# EAGLE design CIRCUIT (EAGLE 9.6.2)
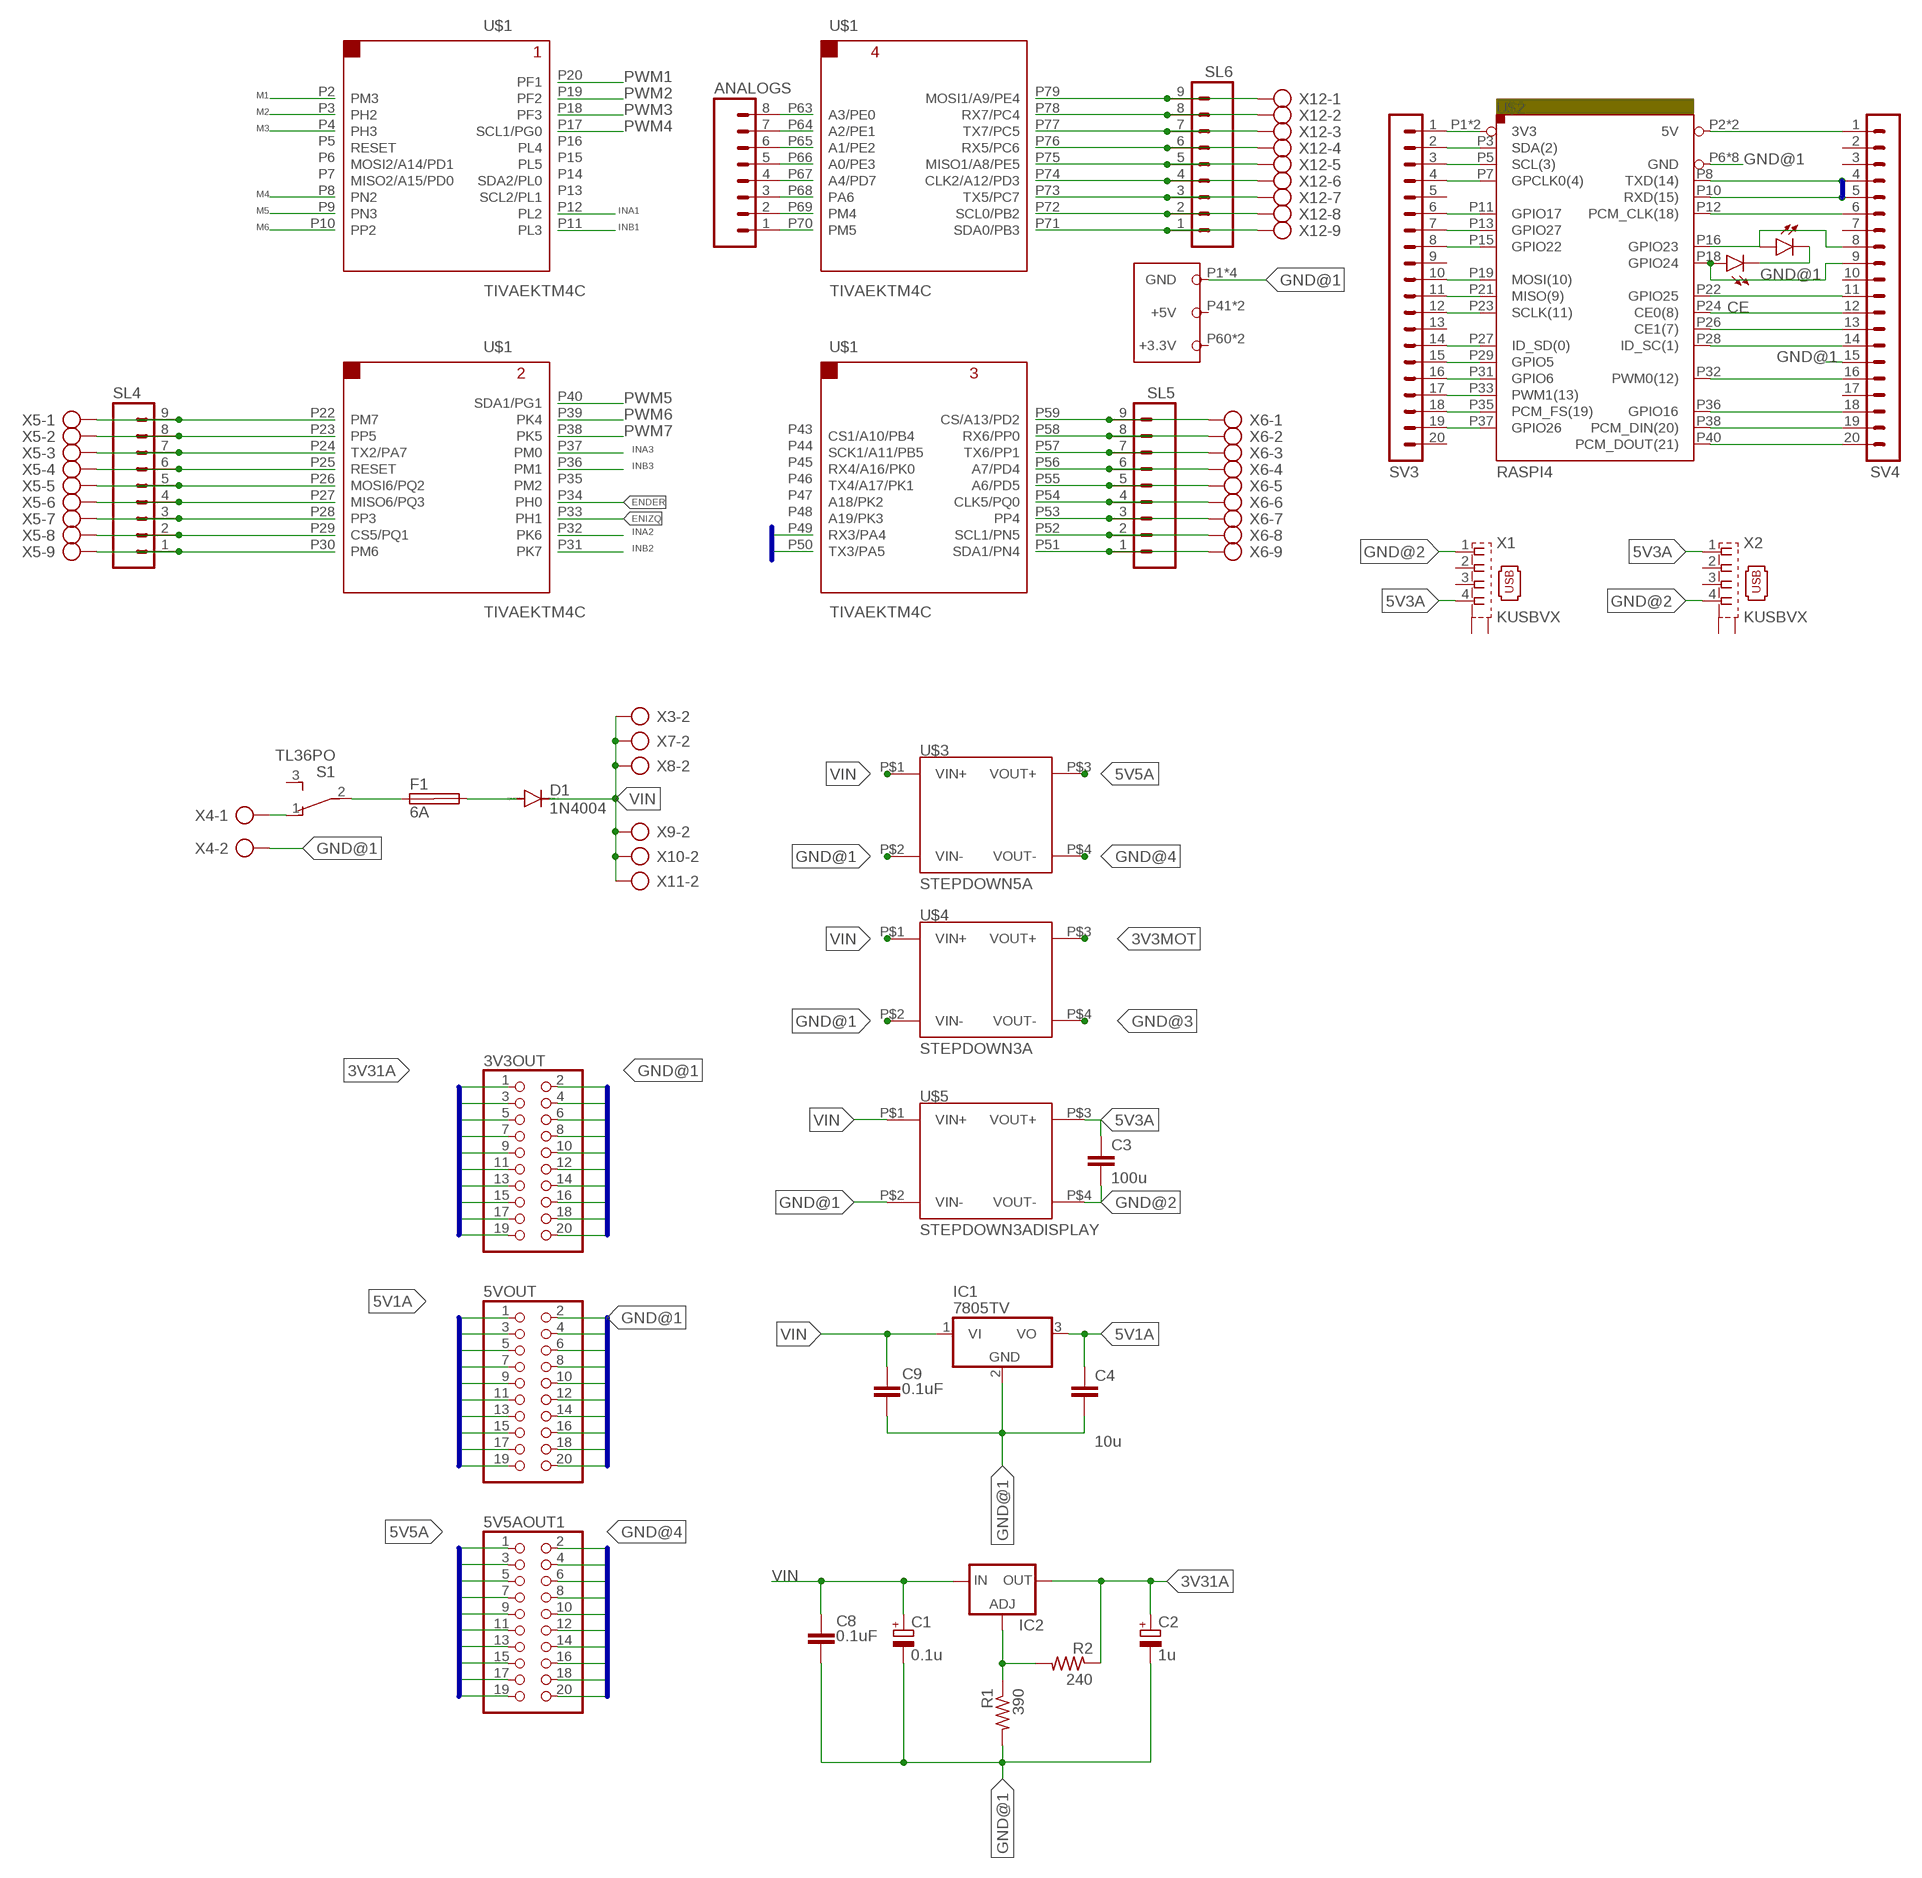
[diagram p0: schematic, sheet 1, part 1 of 2]
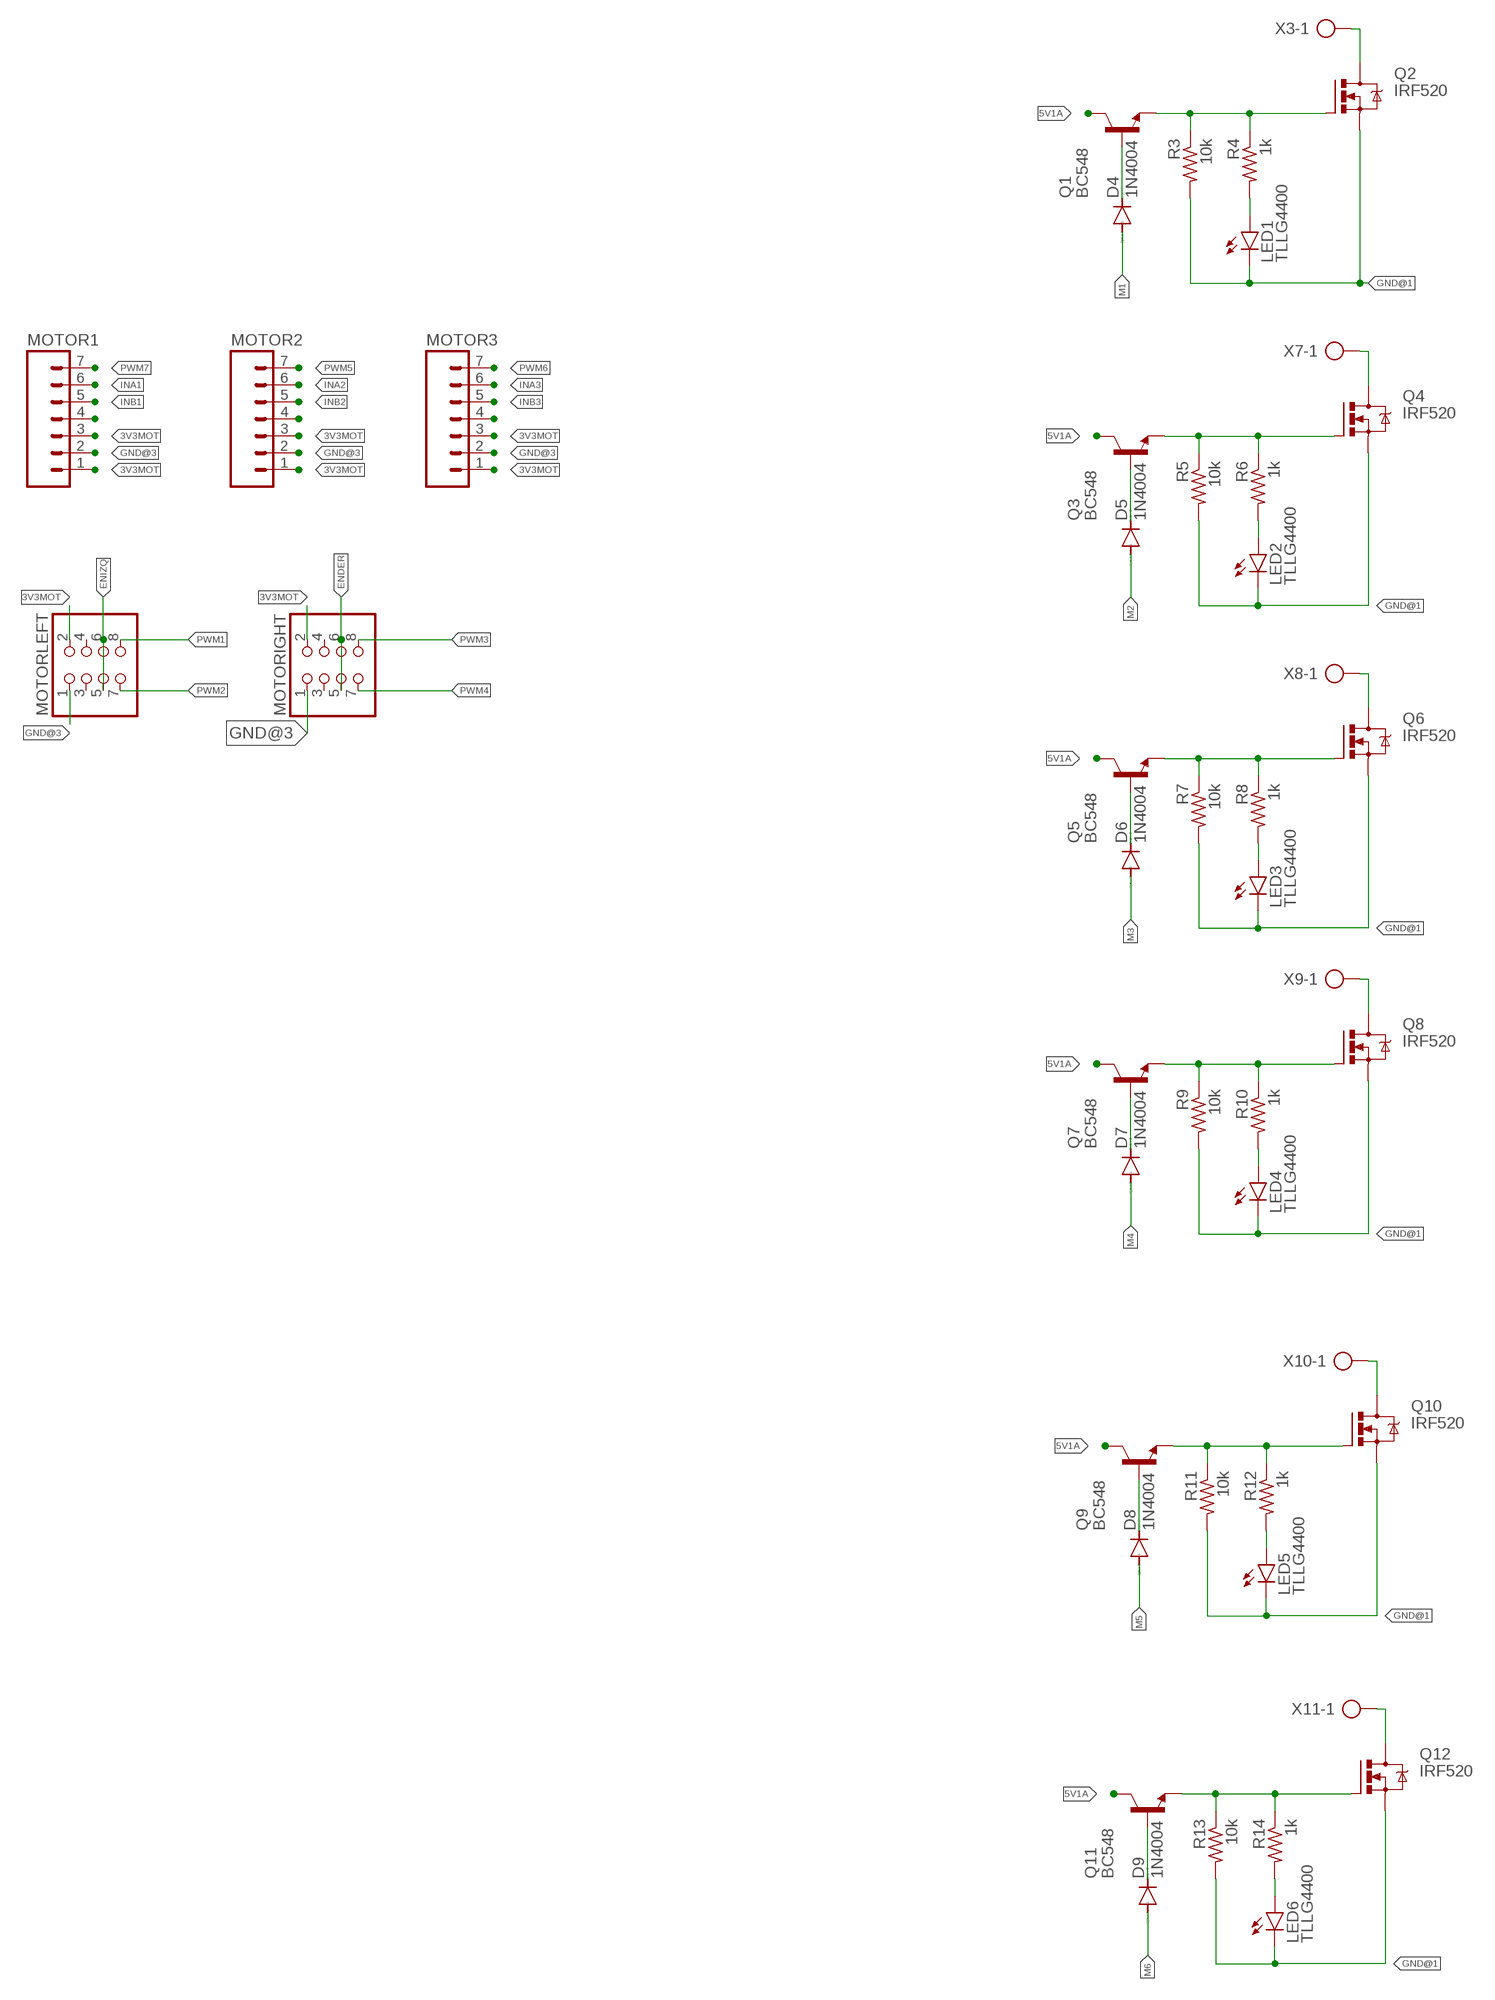
[diagram p1: schematic, sheet 1, part 2 of 2]

## Parts
3V3OUT  PINHD-2X10  [2X10]
5V5AOUT1  PINHD-2X10  [2X10]
5VOUT  PINHD-2X10  [2X10]
ANALOGS  MA08  [08PA]
C1  0.1u  CPOL-EUE5-10.5  [E5-10,5]
C2  1u  CPOL-EUE5-10.5  [E5-10,5]
C3  100u  C-EU025-024X044  [C025-024X044]
C4  10u  C-EU025-024X044  [C025-024X044]
C8  0.1uF  C-EU075-052X106  [C075-052X106]
C9  0.1uF  C-EU075-052X106  [C075-052X106]
D1  1N4004  [DO41-10]
D2  SFH482  [SFH482]
D3  SFH482  [SFH482]
D4  1N4004  [DO41-10]
D5  1N4004  [DO41-10]
D6  1N4004  [DO41-10]
D7  1N4004  [DO41-10]
D8  1N4004  [DO41-10]
D9  1N4004  [DO41-10]
F1  6A  SHK20L  [SHK20L]
IC1  7805TV  [TO220V]
IC2  LM317TL  [317TL]
LED1  TLLG4400  [LED3MM]
LED2  TLLG4400  [LED3MM]
LED3  TLLG4400  [LED3MM]
LED4  TLLG4400  [LED3MM]
LED5  TLLG4400  [LED3MM]
LED6  TLLG4400  [LED3MM]
MOTOR1  MA07  [07PA]
MOTOR2  MA07  [07PA]
MOTOR3  MA07  [07PA]
MOTORIGHT  PINHD-2X4  [2X04]
MOTORLEFT  PINHD-2X4  [2X04]
Q1  BC548  [TO92-EBC]
Q2  IRF520  [TO220BV]
Q3  BC548  [TO92-EBC]
Q4  IRF520  [TO220BV]
Q5  BC548  [TO92-EBC]
Q6  IRF520  [TO220BV]
Q7  BC548  [TO92-EBC]
Q8  IRF520  [TO220BV]
Q9  BC548  [TO92-EBC]
Q10  IRF520  [TO220BV]
Q11  BC548  [TO92-EBC]
Q12  IRF520  [TO220BV]
R1  390  R-US_0207/10  [0207/10]
R2  240  R-US_0207/10  [0207/10]
R3  10k  R-US_0207/10  [0207/10]
R4  1k  R-US_0207/10  [0207/10]
R5  10k  R-US_0207/10  [0207/10]
R6  1k  R-US_0207/10  [0207/10]
R7  10k  R-US_0207/10  [0207/10]
R8  1k  R-US_0207/10  [0207/10]
R9  10k  R-US_0207/10  [0207/10]
R10  1k  R-US_0207/10  [0207/10]
R11  10k  R-US_0207/10  [0207/10]
R12  1k  R-US_0207/10  [0207/10]
R13  10k  R-US_0207/10  [0207/10]
R14  1k  R-US_0207/10  [0207/10]
S1  TL36PO  [TL3XPO]
SL4  M09  [09P]
SL5  M09  [09P]
SL6  M09  [09P]
SV3  MA20-1  [MA20-1]
SV4  MA20-1  [MA20-1]
U$1  TIVAEKTM4C  [TIVAPINESPCB]
U$2  RASPI4  [CONN2-SIL40]
U$3  STEPDOWN5A  [REGULADORSTEP-DOWN5ACURRENT]
U$4  STEPDOWN3A  [REGULADORSTEP-DOWN3A]
U$5  STEPDOWN3ADISPLAY  [REGULADORWITHDISPLAY]
X1  KUSBVX  [KUSBVX]
X2  KUSBVX  [KUSBVX]
X3  AK300/2  [AK300/2]
X4  AK300/2  [AK300/2]
X5  AK300/9  [AK300/9]
X6  AK300/9  [AK300/9]
X7  AK300/2  [AK300/2]
X8  AK300/2  [AK300/2]
X9  AK300/2  [AK300/2]
X10  AK300/2  [AK300/2]
X11  AK300/2  [AK300/2]
X12  AK300/9  [AK300/9]

## Nets
3V3MOT [outsVoltaje]: MOTOR1.1 MOTOR1.3 MOTOR2.1 MOTOR2.3 MOTOR3.1 MOTOR3.3 MOTORIGHT.2 MOTORLEFT.2 U$4.P$3(VOUT+)
3V31A [outsVoltaje]: 3V3OUT.1 3V3OUT.3 3V3OUT.5 3V3OUT.7 3V3OUT.9 3V3OUT.11 3V3OUT.13 3V3OUT.15 3V3OUT.17 3V3OUT.19 C2.+ IC2.2(OUT) R2.1
5V1A [outsVoltaje]: 5VOUT.1 5VOUT.3 5VOUT.5 5VOUT.7 5VOUT.9 5VOUT.11 5VOUT.13 5VOUT.15 5VOUT.17 5VOUT.19 C4.1 IC1.3(VO) Q1.C Q3.C Q5.C Q7.C Q9.C Q11.C
5V3A [outsVoltaje]: C3.1 U$5.P$3(VOUT+) X1.4 X2.1
5V5A [outsVoltaje]: 5V5AOUT1.1 5V5AOUT1.3 5V5AOUT1.5 5V5AOUT1.7 5V5AOUT1.9 5V5AOUT1.11 5V5AOUT1.13 5V5AOUT1.15 5V5AOUT1.17 5V5AOUT1.19 U$3.P$3(VOUT+)
CE: SV4.12 U$2.P24(CE0(8))
CLK [signals]: SV3.12 U$2.P23(SCLK(11))
ENDER [signals]: MOTORIGHT.5 MOTORIGHT.6 U$1.P34(PH0)
ENIZQ [signals]: MOTORLEFT.5 MOTORLEFT.6 U$1.P33(PH1)
GND@1 [gnds]: 3V3OUT.2 3V3OUT.4 3V3OUT.6 3V3OUT.8 3V3OUT.10 3V3OUT.12 3V3OUT.14 3V3OUT.16 3V3OUT.18 3V3OUT.20 5VOUT.2 5VOUT.4 5VOUT.6 5VOUT.8 5VOUT.10 5VOUT.12 5VOUT.14 5VOUT.16 5VOUT.18 5VOUT.20 C4.2 C9.2 D2.K(C) D3.K(C) IC1.2(GND) LED1.K(C) LED2.K(C) LED3.K(C) LED4.K(C) LED5.K(C) LED6.K(C) Q2.S Q4.S Q6.S Q8.S Q10.S Q12.S R3.2 R5.2 R7.2 R9.2 R11.2 R13.2 SV4.15 U$1.P1(GND) U$1.P21(GND) U$1.P42(GND) U$1.P62(GND) U$2.P6(GND) U$2.P9(GND) U$2.P14(GND) U$2.P20(GND) U$2.P25(GND) U$2.P30(GND) U$2.P34(GND) U$2.P39(GND) U$3.P$2(VIN-) U$4.P$2(VIN-) U$5.P$2(VIN-) X4.2
GND@2 [gnds]: C3.2 U$5.P$4(VOUT-) X1.1 X2.4
GND@3 [gnds]: MOTOR1.2 MOTOR2.2 MOTOR3.2 MOTORIGHT.1 MOTORLEFT.1 U$4.P$4(VOUT-)
GND@4 [gnds]: 5V5AOUT1.2 5V5AOUT1.4 5V5AOUT1.6 5V5AOUT1.8 5V5AOUT1.10 5V5AOUT1.12 5V5AOUT1.14 5V5AOUT1.16 5V5AOUT1.18 5V5AOUT1.20 U$3.P$4(VOUT-)
INA1 [signals]: MOTOR1.6 U$1.P12(PL2)
INA2 [signals]: MOTOR2.6 U$1.P32(PK6)
INA3 [signals]: MOTOR3.6 U$1.P37(PM0)
INB1 [signals]: MOTOR1.5 U$1.P11(PL3)
INB2 [signals]: MOTOR2.5 U$1.P31(PK7)
INB3 [signals]: MOTOR3.5 U$1.P36(PM1)
M1 [signals]: D4.A U$1.P2(PM3)
M2 [signals]: D5.A U$1.P3(PH2)
M3 [signals]: D6.A U$1.P4(PH3)
M4 [signals]: D7.A U$1.P8(PN2)
M5 [signals]: D8.A U$1.P9(PN3)
M6 [signals]: D9.A U$1.P10(PP2)
MISO [signals]: SV3.10 SV3.11 U$2.P19(MOSI(10)) U$2.P21(MISO(9))
N$1: S1.1(O) X4.1
N$2: F1.1A S1.2(P)
N$3: IC2.1(ADJ) R1.1 R2.2
N$4: SV3.1 U$2.P1(3V3) U$2.P17(3V3)
N$5: C1.- C2.- C8.2 R1.2
N$8: SV3.2 U$2.P3(SDA(2))
N$9: SV3.3 U$2.P5(SCL(3))
N$10: SV3.4 U$2.P7(GPCLK0(4))
N$11: SV3.6 U$2.P11(GPIO17)
N$12: SV3.7 U$2.P13(GPIO27)
N$13: SV3.8 U$2.P15(GPIO22)
N$14: D1.A F1.2A
N$15: MOTOR2.4
N$16: MOTOR3.4
N$17: SV3.14 U$2.P27(ID_SD(0))
N$18: SV3.15 U$2.P29(GPIO5)
N$19: SV3.16 U$2.P31(GPIO6)
N$20: SV3.17 U$2.P33(PWM1(13))
N$21: SV3.18 U$2.P35(PCM_FS(19))
N$22: SV3.19 U$2.P37(GPIO26)
N$23: SV4.1 U$2.P2(5V) U$2.P4(5V)
N$24: D4.C Q1.B
N$25: MOTOR1.4
N$26: SV4.6 U$2.P12(PCM_CLK(18))
N$27: D3.A SV4.9 U$2.P18(GPIO24)
N$28: Q1.E Q2.G R3.1 R4.1
N$29: SV4.11 U$2.P22(GPIO25)
N$30: LED1.A R4.2
N$31 [signals]: D5.C Q3.B
N$32: SV4.13 U$2.P26(CE1(7))
N$33: SV4.14 U$2.P28(ID_SC(1))
N$34: SV4.16 U$2.P32(PWM0(12))
N$35: SV4.18 U$2.P36(GPIO16)
N$36: SV4.19 U$2.P38(PCM_DIN(20))
N$37: SV4.20 U$2.P40(PCM_DOUT(21))
N$38: D2.A SV4.8 U$2.P16(GPIO23)
N$39: Q2.D X3.1
N$40: SL4.9 U$1.P22(PM7) X5.1
N$41: Q3.E Q4.G R5.1 R6.1
N$42: LED2.A R6.2
N$43 [signals]: Q4.D X7.1
N$44: D6.C Q5.B
N$45: Q5.E Q6.G R7.1 R8.1
N$46: LED3.A R8.2
N$47: Q6.D X8.1
N$48: D7.C Q7.B
N$49: Q7.E Q8.G R9.1 R10.1
N$50: LED4.A R10.2
N$51: Q8.D X9.1
N$52: D8.C Q9.B
N$53: Q9.E Q10.G R11.1 R12.1
N$54: LED5.A R12.2
N$55: Q10.D X10.1
N$56: D9.C Q11.B
N$57: Q11.E Q12.G R13.1 R14.1
N$58: LED6.A R14.2
N$59: Q12.D X11.1
N$60: SL4.8 U$1.P23(PP5) X5.2
N$61: SL4.7 U$1.P24(TX2/PA7) X5.3
N$62: SL4.6 U$1.P25(RESET) X5.4
N$63: SL4.5 U$1.P26(MOSI6/PQ2) X5.5
N$64: SL4.4 U$1.P27(MISO6/PQ3) X5.6
N$65: SL4.3 U$1.P28(PP3) X5.7
N$66: SL4.2 U$1.P29(CS5/PQ1) X5.8
N$67: SL4.1 U$1.P30(PM6) X5.9
N$68: SL6.9 U$1.P79(MOSI1/A9/PE4) X12.1
N$69: SL6.8 U$1.P78(RX7/PC4) X12.2
N$70: SL6.7 U$1.P77(TX7/PC5) X12.3
N$71: SL6.6 U$1.P76(RX5/PC6) X12.4
N$72: SL6.5 U$1.P75(MISO1/A8/PE5) X12.5
N$73: SL6.4 U$1.P74(CLK2/A12/PD3) X12.6
N$74: SL6.3 U$1.P73(TX5/PC7) X12.7
N$75: SL6.2 U$1.P72(SCL0/PB2) X12.8
N$76: SL6.1 U$1.P71(SDA0/PB3) X12.9
N$77: SL5.9 U$1.P59(CS/A13/PD2) X6.1
N$78: SL5.8 U$1.P58(RX6/PP0) X6.2
N$79: SL5.7 U$1.P57(TX6/PP1) X6.3
N$80: SL5.6 U$1.P56(A7/PD4) X6.4
N$81: SL5.5 U$1.P55(A6/PD5) X6.5
N$82: SL5.4 U$1.P54(CLK5/PQ0) X6.6
N$83: SL5.3 U$1.P53(PP4) X6.7
N$84: SL5.2 U$1.P52(SCL1/PN5) X6.8
N$85: SL5.1 U$1.P51(SDA1/PN4) X6.9
N$86: ANALOGS.8 U$1.P63(A3/PE0)
N$87: ANALOGS.7 U$1.P64(A2/PE1)
N$88: ANALOGS.6 U$1.P65(A1/PE2)
N$89: ANALOGS.5 U$1.P66(A0/PE3)
N$90: ANALOGS.4 U$1.P67(A4/PD7)
N$91: ANALOGS.3 U$1.P68(PA6)
N$92: ANALOGS.2 U$1.P69(PM4)
N$93: ANALOGS.1 U$1.P70(PM5)
PWM1: MOTORLEFT.8 U$1.P20(PF1)
PWM2 [signals]: MOTORLEFT.7 U$1.P19(PF2)
PWM3 [signals]: MOTORIGHT.8 U$1.P18(PF3)
PWM4 [signals]: MOTORIGHT.7 U$1.P17(SCL1/PG0)
PWM5 [signals]: MOTOR2.7 U$1.P40(SDA1/PG1)
PWM6 [signals]: MOTOR3.7 U$1.P39(PK4)
PWM7: MOTOR1.7 U$1.P38(PK5)
RX [signals]: SV4.5 U$2.P10(RXD(15))
RX3 [signals]: U$1.P49(RX3/PA4)
TX [signals]: SV4.4 U$2.P8(TXD(14))
TX3 [signals]: U$1.P50(TX3/PA5)
VIN [VInbat]: C1.+ C8.1 C9.1 D1.C IC1.1(VI) IC2.3(IN) U$3.P$1(VIN+) U$4.P$1(VIN+) U$5.P$1(VIN+) X3.2 X7.2 X8.2 X9.2 X10.2 X11.2
Unconnected: F1.1B F1.2B MOTORIGHT.3 MOTORIGHT.4 MOTORLEFT.3 MOTORLEFT.4 S1.3(S) SV3.5 SV3.9 SV3.13 SV3.20 SV4.2 SV4.3 SV4.7 SV4.10 SV4.17 U$1.P5(RESET) U$1.P6(MOSI2/A14/PD1) U$1.P7(MISO2/A15/PD0) U$1.P13(SCL2/PL1) U$1.P14(SDA2/PL0) U$1.P15(PL5) U$1.P16(PL4) U$1.P35(PM2) U$1.P41(+5V) U$1.P43(CS1/A10/PB4) U$1.P44(SCK1/A11/PB5) U$1.P45(RX4/A16/PK0) U$1.P46(TX4/A17/PK1) U$1.P47(A18/PK2) U$1.P48(A19/PK3) U$1.P60(+3.3V) U$1.P61(+5V) U$1.P80(+3.3V) X1.2 X1.3 X1.M1(S1) X1.M2(S2) X2.2 X2.3 X2.M1(S1) X2.M2(S2)

## Buses
5V1A:5V1A
GNDS:GND@1
3V31AS:3V31A
UARTIVA:RX3,TX3
UARTRASP:RX,TX
5V5A
GND@4

## Library data of the parts
3V3OUT 5V5AOUT1 5VOUT = pinhead:PINHD-2X10: PIN HEADER
ANALOGS = con-amp-quick:MA08: AMP QUICK CONNECTOR; OC_FARNELL: unknown; OC_NEWARK: unknown
C1 C2 = rcl:CPOL-EU: POLARIZED CAPACITOR, European symbol; SPICEPREFIX: C
C3 C4 C8 C9 = rcl:C-EU: CAPACITOR, European symbol; SPICEPREFIX: C
D1 D4-D9 = diode:1N4004: DIODE general purpose rectifier, 1 A
D2 D3 = led:SFH482: IR LED infrared emitting diode, Infineon
F1 = fuse:SHK20L: FUSE HOLDER 5 x 20 mm, SH contact, SHH1 Schukat, E1073 Buerklin; OC_FARNELL: unknown; OC_NEWARK: unknown
IC1 = linear:78*: Positive VOLTAGE REGULATOR Source: http://cache.national.com/ds/LM/LM78L05.pdf http://www.fairchildsemi.com/ds/LM/LM7805.pdf
IC2 = v-reg:LM317TL: VOLTAGE REGULATOR
LED1-LED6 = led:TLLG4400: Low Current (2mA) LED 3 mm Tinted Diffused Package color GREEN Source: Data sheet <http://www.farnell.com/datasheets/391098.pdf>; MF: VISHAY SEMICONDUCTOR; OC_FARNELL: 1612435
MOTOR1-MOTOR3 = con-amp-quick:MA07: AMP QUICK CONNECTOR; OC_FARNELL: unknown; OC_NEWARK: unknown
MOTORIGHT MOTORLEFT = pinhead:PINHD-2X4: PIN HEADER
Q1 Q3 Q5 Q7 Q9 Q11 = transistor-npn:BC548*: NPN Transistor
Q2 Q4 Q6 Q8 Q10 Q12 = transistor-power:IRF520: HEXFET Power MOSFET
R1-R14 = rcl:R-US_: RESISTOR, American symbol; SPICEPREFIX: R
S1 = switch:TL36PO: TINY SWITCH ON - ON Source: http://www2.produktinfo.conrad.com/datenblaetter/700000-724999/705152-da-01-de-Subminiaturschalter_TL_36YO.pdf
SL4-SL6 = con-amp-quick:M09: AMP QUICK CONNECTOR; OC_FARNELL: unknown; OC_NEWARK: unknown
SV3 SV4 = con-lstb:MA20-1: PIN HEADER; OC_FARNELL: unknown; OC_NEWARK: unknown
U$1 = TivaConnector:TIVAEKTM4C
U$2 = RaspConnector:RASPI4
U$3 = ReguladoresStep:STEPDOWN5A
U$4 = ReguladoresStep:STEPDOWN3A
U$5 = ReguladoresStep:STEPDOWN3ADISPLAY
X1 X2 = con-kycon:KUSBVX: Vertical,Top Entry Universal Serial Bus Connector KUSBVX Series Source: KYCON Sibalco USB vertical socket KUSBV.pdf
X3 X4 X7-X11 = con-ptr500:AK300/2: CONNECTOR; OC_FARNELL: unknown; OC_NEWARK: unknown
X5 X6 X12 = con-ptr500:AK300/9: CONNECTOR; OC_FARNELL: unknown; OC_NEWARK: unknown

## Net classes
0 default: width 1.016 mm, drill 2.032 mm, clearance 0.508 mm
3 VInbat: width 2.032 mm, drill 2.032 mm, clearance 0.508 mm
5 outsVoltaje: width 1.524 mm, drill 2.032 mm, clearance 0.508 mm
6 signals: width 1.016 mm, drill 2.032 mm, clearance 0.508 mm
7 gnds: width 0.762 mm, drill 2.032 mm, clearance 0.508 mm

## Board
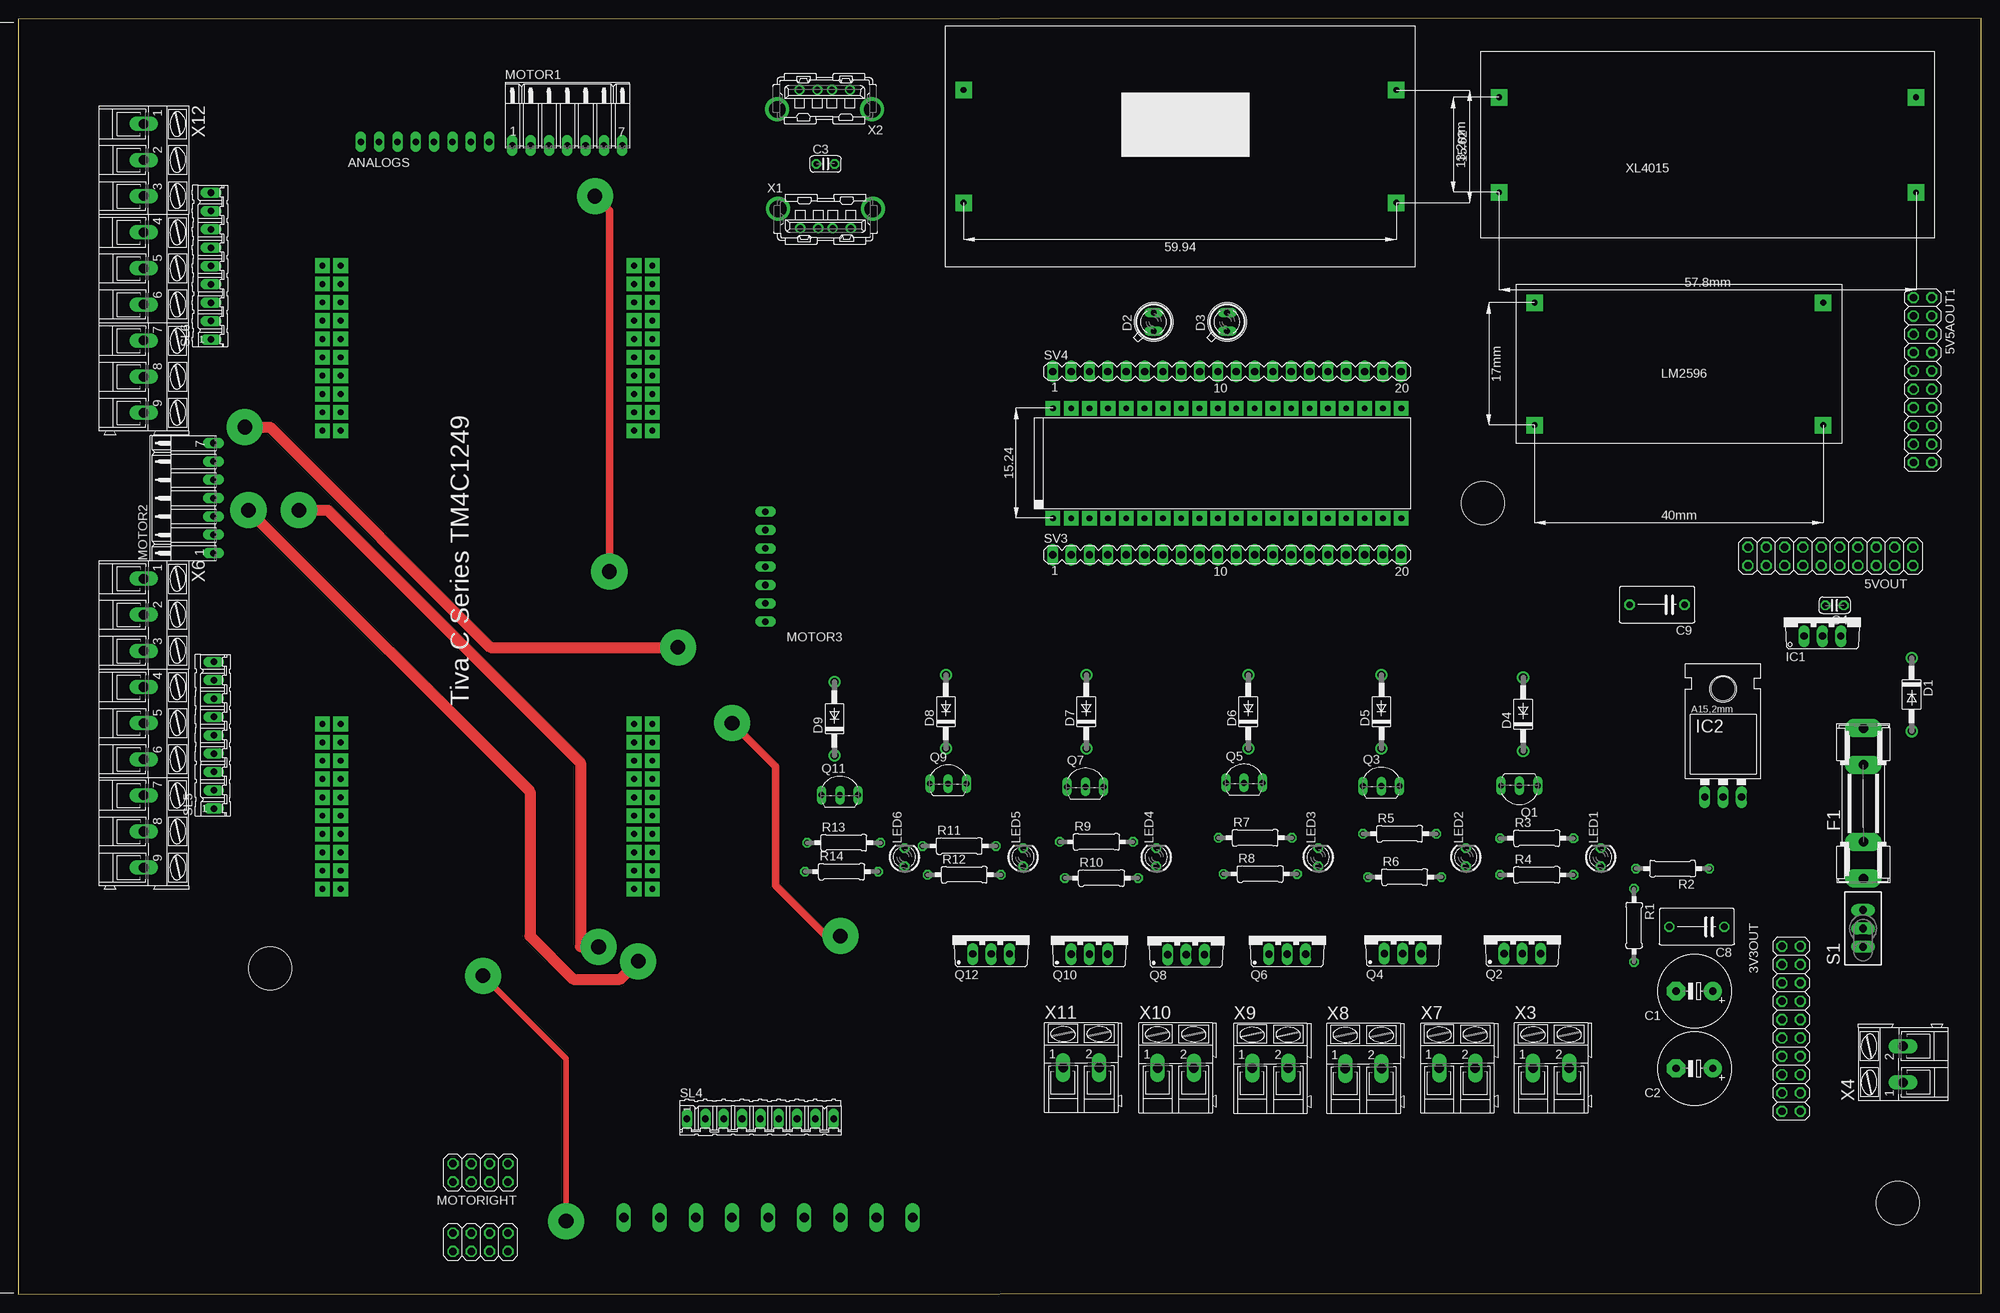
[diagram p2: board, top side]
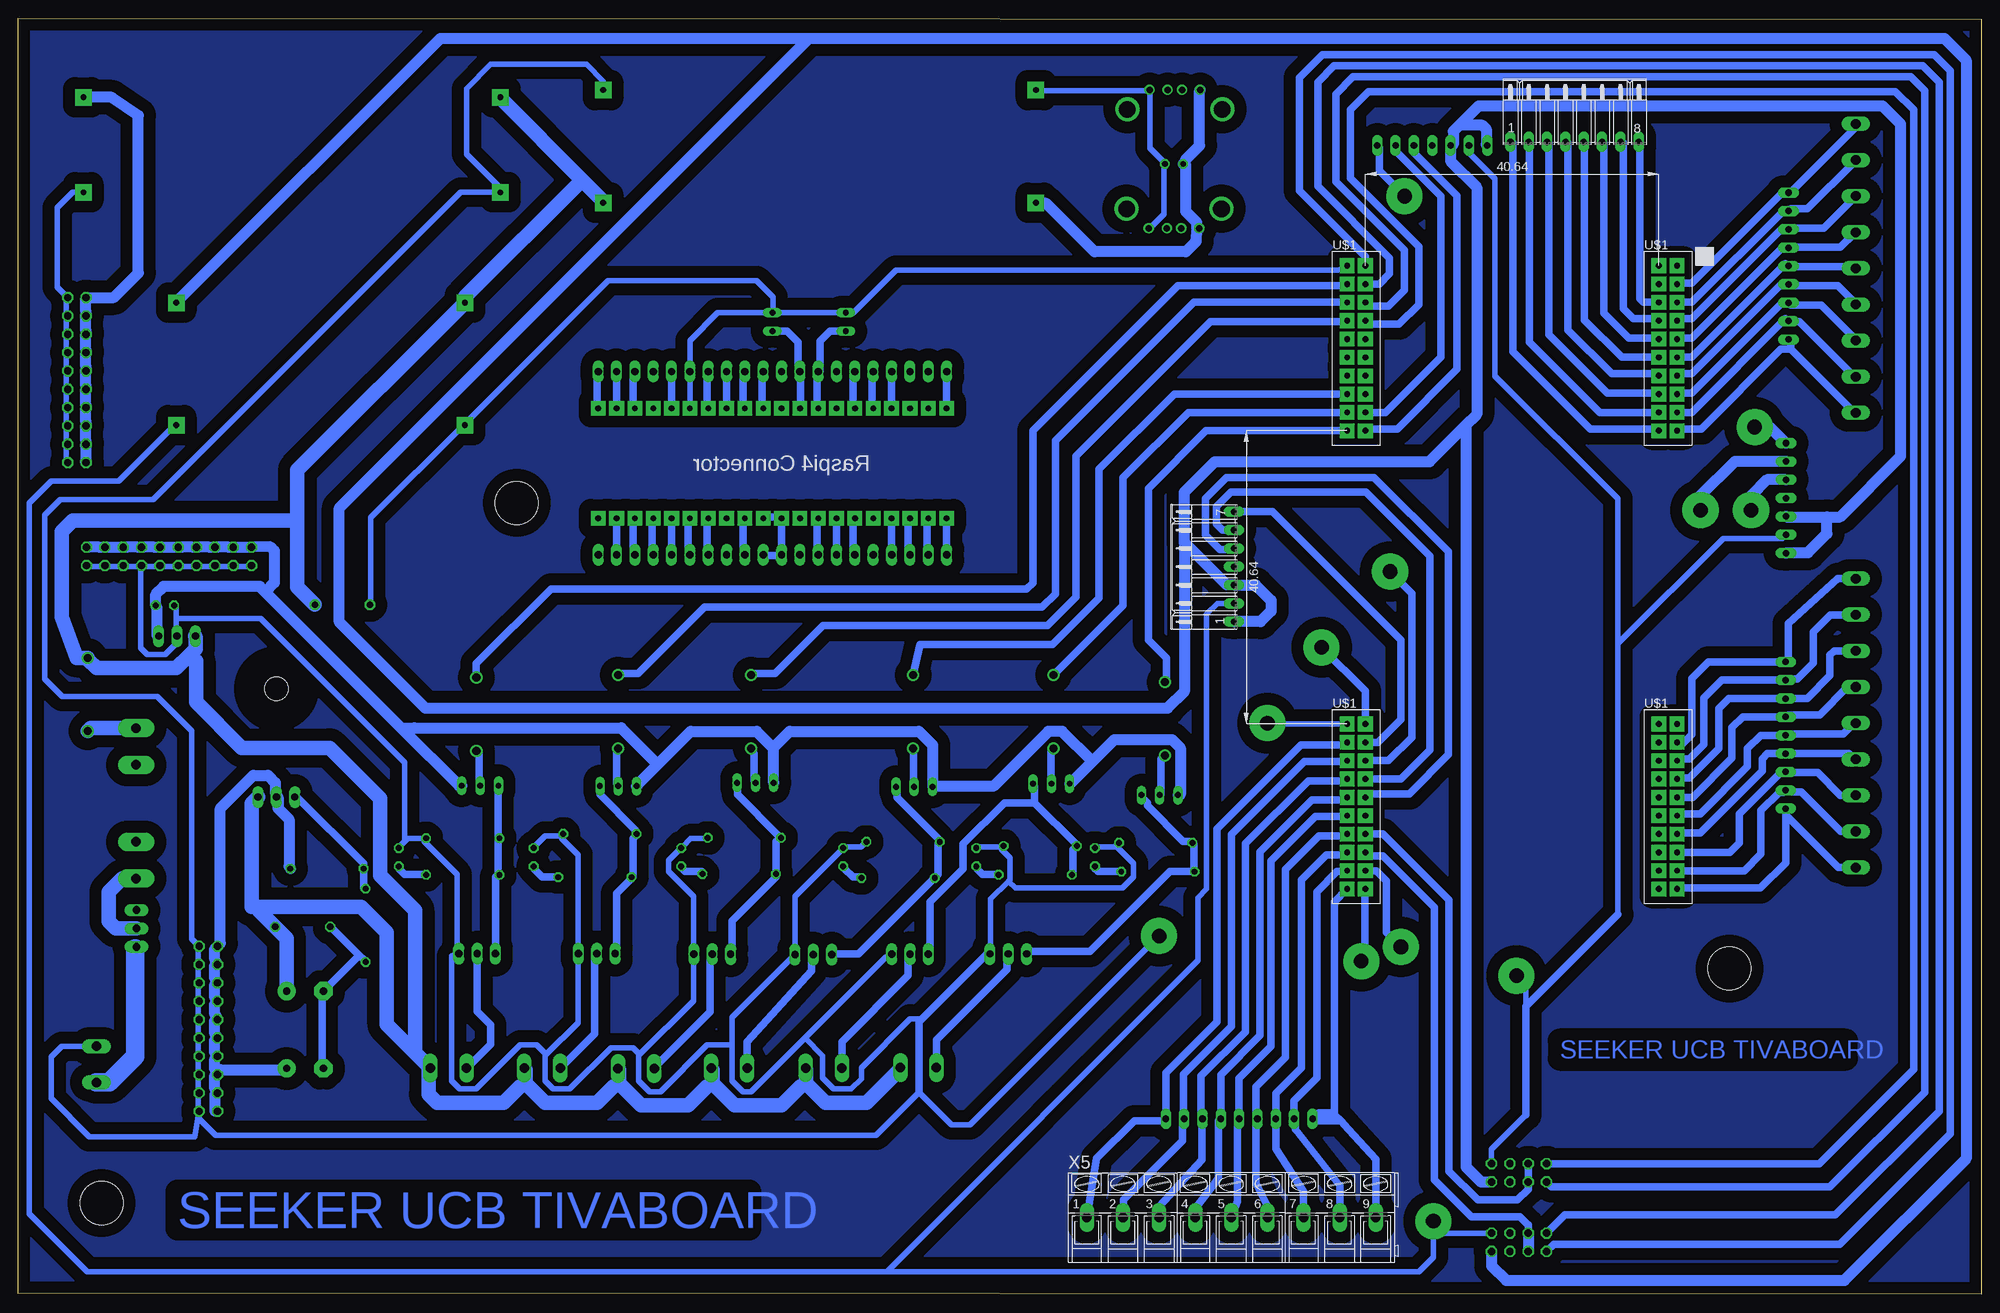
[diagram p3: board, bottom side, seen from below]

Size 271.98 x 176.84 mm. Coordinates in mm from the lower left corner, seen from the top.
Outline: 0,0 271.98,0.2 271.98,176.84 0,176.64 0,0
Copper layers (1*16): Top 0.035mm / dielectric 1.5mm / Bottom 0.035mm
Design rules "default": minimum track width 6mil, minimum drill 0.35mm, track to track 6mil, track to pad 6mil, pad to pad 6mil, via to via 6mil, smd to smd 6mil, copper to edge 40mil, drill to drill 6mil, minimum pad ring 10mil, minimum via ring 8mil, stop-mask expansion 4mil, vias tented up to drill 0mil, thermal gap 10mil
Holes 6 mm at 260.41,12.66 34.91,45.16 202.91,109.66

### Footprints (pad centres in the part's own frame; a part is rotated, then mirrored left to right if it is on the bottom)
2X10 = drill 1.016 octagon: 1 -11.43,-1.27; 2 -11.43,1.27; 3 -8.89,-1.27; 4 -8.89,1.27; 5 -6.35,-1.27; 6 -6.35,1.27; 7 -3.81,-1.27; 8 -3.81,1.27; 9 -1.27,-1.27; 10 -1.27,1.27; 11 1.27,-1.27; 12 1.27,1.27; 13 3.81,-1.27; 14 3.81,1.27; 15 6.35,-1.27; 16 6.35,1.27; 17 8.89,-1.27; 18 8.89,1.27; 19 11.43,-1.27; 20 11.43,1.27
08PA = drill 0.914 long: 1 -8.89,0; 2 -6.35,0; 3 -3.81,0; 4 -1.27,0; 5 1.27,0; 6 3.81,0; 7 6.35,0; 8 8.89,0
E5-10,5 = drill 1.016 pad 2.54: + -2.54,0 | drill 1.016 pad 2.54 octagon: - 2.54,0
C025-024X044 = drill 0.813 octagon: 1 -1.27,0; 2 1.27,0
C075-052X106 = drill 0.914 octagon: 1 -3.81,0; 2 3.81,0
DO41-10 = drill 1.118: A 5.08,0; C -5.08,0
SFH482 = drill 0.813 long: A -1.27,0; K 1.27,0
SHK20L = drill 1.321 pad 2.54 long: 1A -10.414,0; 1B -5.334,0; 2A 10.414,0; 2B 5.334,0
TO220V = drill 1.016 long: 1 -2.54,-2.54; 2 0,-2.54; 3 2.54,-2.54
317TL = drill 1.016 long: 1 -2.54,-3.81; 2 0,-3.81; 3 2.54,-3.81 | hole 3.302: 0,11.176
LED3MM = drill 0.813 octagon: A -1.27,0; K 1.27,0
07PA = drill 0.914 long: 1 -7.62,0; 2 -5.08,0; 3 -2.54,0; 4 0,0; 5 2.54,0; 6 5.08,0; 7 7.62,0
2X04 = drill 1.016 octagon: 1 -3.81,-1.27; 2 -3.81,1.27; 3 -1.27,-1.27; 4 -1.27,1.27; 5 1.27,-1.27; 6 1.27,1.27; 7 3.81,-1.27; 8 3.81,1.27
TO92-EBC = drill 0.813 long: B 0,-1.27; C -2.54,-1.27; E 2.54,-1.27
TO220BV = drill 1.016 long: D 0,-2.54; G -2.54,-2.54; S 2.54,-2.54
0207/10 = drill 0.813 octagon: 1 -5.08,0; 2 5.08,0
TL3XPO = drill 1.1 pad 1.422 long: 1 -2.54,0; 2 0,0; 3 2.54,0
09P = drill 0.914 long: 1 -10.16,0; 2 -7.62,0; 3 -5.08,0; 4 -2.54,0; 5 0,0; 6 2.54,0; 7 5.08,0; 8 7.62,0; 9 10.16,0
MA20-1 = drill 1.016 long: 1 -24.13,0; 2 -21.59,0; 3 -19.05,0; 4 -16.51,0; 5 -13.97,0; 6 -11.43,0; 7 -8.89,0; 8 -6.35,0; 9 -3.81,0; 10 -1.27,0; 11 1.27,0; 12 3.81,0; 13 6.35,0; 14 8.89,0; 15 11.43,0; 16 13.97,0; 17 16.51,0; 18 19.05,0; 19 21.59,0; 20 24.13,0
TIVAPINESPCB = drill 0.8 pad 2.032 square: P1 -1.27,11.43; P2 -1.27,8.89; P3 -1.27,6.35; P4 -1.27,3.81; P5 -1.27,1.27; P6 -1.27,-1.27; P7 -1.27,-3.81; P8 -1.27,-6.35; P9 -1.27,-8.89; P10 -1.27,-11.43; P11 1.27,-11.43; P12 1.27,-8.89; P13 1.27,-6.35; P14 1.27,-3.81; P15 1.27,-1.27; P16 1.27,1.27; P17 1.27,3.81; P18 1.27,6.35; P19 1.27,8.89; P20 1.27,11.43; P21 -1.27,-52.07; P22 -1.27,-54.61; P23 -1.27,-57.15; P24 -1.27,-59.69; P25 -1.27,-62.23; P26 -1.27,-64.77; P27 -1.27,-67.31; P28 -1.27,-69.85; P29 -1.27,-72.39; P30 -1.27,-74.93; P31 1.27,-74.93; P32 1.27,-72.39; P33 1.27,-69.85; P34 1.27,-67.31; P35 1.27,-64.77; P36 1.27,-62.23; P37 1.27,-59.69; P38 1.27,-57.15; P39 1.27,-54.61; P40 1.27,-52.07; P41 41.91,-52.07; P42 41.91,-54.61; P43 41.91,-57.15; P44 41.91,-59.69; P45 41.91,-62.23; P46 41.91,-64.77; P47 41.91,-67.31; P48 41.91,-69.85; P49 41.91,-72.39; P50 41.91,-74.93; P51 44.45,-74.93; P52 44.45,-72.39; P53 44.45,-69.85; P54 44.45,-67.31; P55 44.45,-64.77; P56 44.45,-62.23; P57 44.45,-59.69; P58 44.45,-57.15; P59 44.45,-54.61; P60 44.45,-52.07; P61 41.91,11.43; P62 41.91,8.89; P63 41.91,6.35; P64 41.91,3.81; P65 41.91,1.27; P66 41.91,-1.27; P67 41.91,-3.81; P68 41.91,-6.35; P69 41.91,-8.89; P70 41.91,-11.43; P71 44.45,-11.43; P72 44.45,-8.89; P73 44.45,-6.35; P74 44.45,-3.81; P75 44.45,-1.27; P76 44.45,1.27; P77 44.45,3.81; P78 44.45,6.35; P79 44.45,8.89; P80 44.45,11.43
CONN2-SIL40 = drill 0.8 pad 2.032 square: P1 -7.62,0; P2 7.62,0; P3 -7.62,-2.54; P4 7.62,-2.54; P5 -7.62,-5.08; P6 7.62,-5.08; P7 -7.62,-7.62; P8 7.62,-7.62; P9 -7.62,-10.16; P10 7.62,-10.16; P11 -7.62,-12.7; P12 7.62,-12.7; P13 -7.62,-15.24; P14 7.62,-15.24; P15 -7.62,-17.78; P16 7.62,-17.78; P17 -7.62,-20.32; P18 7.62,-20.32; P19 -7.62,-22.86; P20 7.62,-22.86; P21 -7.62,-25.4; P22 7.62,-25.4; P23 -7.62,-27.94; P24 7.62,-27.94; P25 -7.62,-30.48; P26 7.62,-30.48; P27 -7.62,-33.02; P28 7.62,-33.02; P29 -7.62,-35.56; P30 7.62,-35.56; P31 -7.62,-38.1; P32 7.62,-38.1; P33 -7.62,-40.64; P34 7.62,-40.64; P35 -7.62,-43.18; P36 7.62,-43.18; P37 -7.62,-45.72; P38 7.62,-45.72; P39 -7.62,-48.26; P40 7.62,-48.26
REGULADORSTEP-DOWN5ACURRENT = drill 0.8 pad 2.286 square: P$1 0,-3.81; P$2 0,-16.98; P$3 57.77,-3.81; P$4 57.77,-16.98
REGULADORSTEP-DOWN3A = drill 0.8 pad 2.286 square: P$1 0,0; P$2 0,-16.98; P$3 39.99,0; P$4 39.99,-16.98
REGULADORWITHDISPLAY = drill 0.8 pad 2.286 square: P$1 0,0; P$2 0,-15.621; P$3 59.944,0; P$4 59.944,-15.621
KUSBVX = drill 0.9 pad 1.3: 1 3.5,0; 2 1,0; 3 -1,0; 4 -3.5,0 | drill 2.3 pad 2.8: M1 -6.57,2.71; M2 6.57,2.71
AK300/2 = drill 1.321 long: 1 -2.515,0; 2 2.489,0
AK300/9 = drill 1.321 long: 1 -20.015,0; 2 -15.011,0; 3 -10.008,0; 4 -5.004,0; 5 0,0; 6 5.004,0; 7 10.008,0; 8 15.011,0; 9 20.015,0

### Placement (x,y rotation side)
3V3OUT  245.62,36.81 270 top
5V5AOUT1  263.82,126.68 270 top
5VOUT  251.06,102.25 180 top
ANALOGS  56.36,159.7 0 bottom
C1  232.23,42.02 180 top
C2  232.23,31.32 180 top
C3  111.85,156.63 0 top
C4  251.64,95.47 180 top
C8  232.55,50.94 180 top
C9  227.05,95.56 180 top
D1  262.31,83.12 270 top
D2  157.32,134.75 90 top
D3  167.48,134.75 90 top
D4  208.49,80.4 90 top
D5  188.86,80.75 90 top
D6  170.42,80.75 90 top
D7  147.98,80.75 90 top
D8  128.54,80.75 90 top
D9  113.1,79.75 90 top
F1  255.62,68.04 90 top
IC1  249.96,93.76 0 top
IC2  236.19,72.73 0 top
LED1  219.25,60.59 90 top
LED2  200.56,60.59 90 top
LED3  180.12,60.59 90 top
LED4  157.68,60.59 90 top
LED5  139.24,60.59 90 top
LED6  122.8,60.59 90 top
MOTOR1  76.08,159.2 0 top
MOTOR2  27.08,110.33 90 top
MOTOR3  103.54,100.83 90 bottom
MOTORIGHT  64.05,16.86 180 top
MOTORLEFT  64.05,7.24 180 top
Q1  207.98,69.22 180 top
Q2  208.38,49.78 0 top
Q3  188.84,71.71 0 top
Q4  191.81,49.76 0 top
Q5  169.84,72.15 0 top
Q6  175.81,49.7 0 top
Q7  147.84,71.59 0 top
Q8  161.81,49.64 0 top
Q9  128.84,72.03 0 top
Q10  148.41,49.68 0 top
Q11  113.84,70.47 0 top
Q12  134.81,49.72 0 top
R1  223.85,51.14 270 top
R2  229.2,59 180 top
R3  210.38,63.21 0 top
R4  210.38,58.13 0 top
R5  191.38,63.82 0 top
R6  192.08,57.82 0 top
R7  171.38,63.26 0 top
R8  172.08,58.26 0 top
R9  149.38,62.7 0 top
R10  150.08,57.7 0 top
R11  130.38,62.14 0 top
R12  131.08,58.14 0 top
R13  114.38,62.58 0 top
R14  114.08,58.58 0 top
S1  255.58,50.71 90 top
SL4  102.83,24.34 0 top
SL5  27.11,77.48 90 top
SL6  26.73,142.48 90 top
SV3  167.48,102.46 0 top
SV4  167.48,127.86 0 top
U$1  86.6,131.1 0 bottom
U$2  143.35,115.16 90 top
U$3  205.16,169.67 0 top
U$4  210.08,137.41 0 top
U$5  190.93,151.25 180 top
X1  111.85,147.71 0 top
X2  111.74,166.91 180 top
X3  212.38,31.38 0 top
X4  261.13,31.9 90 top
X5  103.91,10.66 0 bottom
X6  17.41,79.16 270 top
X7  199.38,31.37 0 top
X8  186.38,31.31 0 top
X9  173.48,31.35 0 top
X10  160.38,31.39 0 top
X11  147.28,31.43 0 top
X12  17.41,142.16 270 top

### Tracks (layer width: path | path; a pad name or v marks a point on that pad's centre or on a via)
3V3MOT
  Bottom 1.524: MOTOR1.1 68.6,159.31 68.6,161.45 69.12,161.98 72.35,161.98 | U$4.P$3 250.05,137.45 213.46,174.03 162.41,174.03 | 72.35,161.98 73.17,161.16 73.17,159.31 MOTOR1.3 73.54,157.03 69.91,153.4 69.91,121.93 71.41,120.43 | MOTORLEFT.2 67.86,3.97 65.83,1.94 19,1.94 2.13,18.8 2.13,171.02 5.15,174.03 162.41,174.03 | MOTOR3.1 99.86,93.21 98.41,94.66 98.41,96.16 100.54,98.29 MOTOR3.3 104.54,98.29 110.41,104.16 | 110.41,104.16 110.41,111.16 106.19,115.38 76.46,115.38 71.41,120.43 | 71.41,120.43 71.41,17.66 69.34,15.59 MOTORIGHT.2 | 110.41,104.16 110.41,83.54 112.73,81.22 215.56,81.22 227.47,93.13 227.47,108.97 162.41,174.03 | MOTOR2.1 27.02,102.77 24.05,102.77 21.41,105.41 21.41,107.73 | 72.35,161.98 69.67,164.66 13.69,164.66 11.19,162.16 11.19,116.13 19.59,107.73 21.41,107.73 | MOTOR2.3 27.02,107.73 21.41,107.73
3V31A
  Bottom 1.524: R2.1 234.43,59.35 234.43,65.82 235.95,67.35 235.95,68.87 IC2.2 236.33,69.63 236.33,70.9 237.35,71.92 239.38,71.92 243.95,67.35 243.95,48.68 3V3OUT.1 244.71,47.92 244.71,46.39 3V3OUT.3 244.71,45.63 244.71,43.73 3V3OUT.5 244.71,42.96 244.71,41.06 3V3OUT.7 244.71,40.3 244.71,38.77 3V3OUT.9 244.71,38.01 244.71,36.11 3V3OUT.11 244.71,35.34 244.71,33.44 3V3OUT.13 244.71,32.68 244.71,31.15 244.55,30.84 | 3V3OUT.19 244.71,25.44 244.71,27.72 3V3OUT.17 244.71,28.49 244.71,30.39 3V3OUT.15 244.55,30.84 | C2.+ 234.81,31.15 243.95,31.15 244.55,30.84
5V1A
  Bottom 1.524: 123.17,73.82 126.22,70.78 Q9.C | 123.17,73.82 120.12,76.87 112.12,76.87 110.98,75.73 110.98,69.25 Q11.C | 123.17,73.82 127.36,78.02 129.27,78.02 136.89,70.4 145.27,70.4 Q7.C 145.27,71.16 145.27,76.11 147.18,78.02 165.08,78.02 167.37,75.73 | 5VOUT.1 262.24,103.54 260.71,103.54 5VOUT.3 259.57,103.54 257.67,103.54 5VOUT.5 256.9,103.54 255.38,103.54 5VOUT.7 254.62,103.54 253.09,103.54 5VOUT.9 251.95,103.54 250.05,103.54 5VOUT.11 249.28,103.54 247.76,103.54 5VOUT.13 247,103.54 245.47,103.54 5VOUT.15 244.33,103.54 242.81,103.54 5VOUT.17 242.05,103.54 239.76,103.54 5VOUT.19 237.07,103.61 236.47,103.02 236.47,98.61 237.75,97.34 | IC1.3 252.71,91.35 252.71,95.16 C4.1 252.91,97.01 251.83,98.09 238.5,98.09 237.75,97.34 | 167.37,75.73 167.37,71.16 Q5.C | 167.37,75.73 169.66,78.02 178.8,78.02 183.37,73.44 | 183.37,73.44 186.04,70.78 Q3.C | 183.37,73.44 188.44,78.52 217.05,78.52 217.07,78.49 218.9,78.49 | 237.75,97.34 218.9,78.49 | 218.9,78.49 210.9,70.49 Q1.C
5V3A
  Bottom 1.524: 110.46,156.59 110.22,156.5 110.22,150.03 108.69,148.5 108.69,147.74 108.63,147.73 | 110.46,156.59 C3.1 | 108.63,147.73 X1.4 | X2.1 108.31,166.79 108.31,159.17 110.22,157.26 110.46,156.59 | U$5.P$3 130.79,151.17 129.55,151.17 122.84,144.45 110.22,144.45 108.79,145.88 108.63,147.73
5V5A
  Bottom 1.524: 5V5AOUT1.19 262.62,115.35 262.62,117.64 5V5AOUT1.17 262.62,118.4 262.62,120.31 5V5AOUT1.15 262.62,121.07 262.62,122.59 5V5AOUT1.13 262.62,123.35 262.62,125.26 5V5AOUT1.11 262.62,126.02 262.62,127.93 5V5AOUT1.9 262.62,128.69 262.62,130.21 5V5AOUT1.7 262.62,130.97 262.62,132.88 5V5AOUT1.5 262.62,133.64 262.62,135.55 5V5AOUT1.3 262.62,136.31 262.62,137.83 5V5AOUT1.1 258.72,138.11 255.33,141.5 255.33,163.35 258.98,165.86 U$3.P$3
CE
  Bottom 1.016: SV4.12 171.56,127.55 171.56,122.97 U$2.P24
CLK
  Bottom 1.016: SV3.12 171.56,102.78 171.56,107.35 U$2.P23
ENDER
  Bottom 1.016: MOTORIGHT.5 MOTORIGHT.6 62.78,14.59 64.28,13.09 69.78,13.09 73.77,17.08 73.77,54.66 82.9,63.79 U$1.P34
ENIZQ
  Bottom 1.016: U$1.P33 84.82,60.74 82.89,60.74 75.8,53.65 75.8,15.89 70.65,10.75 63.91,10.75 62.82,9.66 62.78,9.66 MOTORLEFT.6
  Bottom 1.524: MOTORLEFT.5 MOTORLEFT.6
GND@1  (via drill 2.03 pad 5)
  Top 1.016: v98.91,79.16 104.91,73.16 104.91,56.66 111.91,49.66 v113.91,49.66
  Bottom 0.762: 247,27.34 247,27.72 3V3OUT.18 | 247,25.44 247,24.67 247.53,21.84 262.09,21.84 267.41,27.16 267.41,32.89 265.91,34.39 X4.2 | 247,27.34 247,25.44 | 247,25.44 3V3OUT.20 246.89,24.31 244.62,22.03 153.15,22.03 147.06,28.13 147.06,37.56 147.28,37.78 146.91,38.16 | 3V3OUT.18 247,28.1 247,30.39 3V3OUT.16 247,30.77 247,32.68 3V3OUT.14 247,33.06 247,35.34 3V3OUT.12 247,35.72 247,38.01 3V3OUT.10 247,38.39 247,40.3 3V3OUT.8 247,40.68 247,42.96 3V3OUT.6 247,43.34 247,45.63 3V3OUT.4 247,46.01 247,47.92 3V3OUT.2 247.89,49.24 247.89,78.05 252.72,82.87 265.88,82.87 268.31,85.3 268.31,107.97 266.17,110.11 253.23,110.11 210.66,152.69 U$3.P$2 205.47,152.69 205.47,153.6 209.87,158 209.87,167.05 206.49,170.43 193.25,170.43 190.93,168.11 U$5.P$2 | 247,27.34 3V3OUT.18 | LED6.K 122.79,62.01 120.12,62.01 119.74,62.39 R13.2 119.74,62.01 117.46,59.73 117.46,57.82 118.98,56.3 133.84,56.3 134.79,57.25 | LED5.K 139.18,62.01 135.75,62.01 R11.2 135.75,61.63 134.6,60.49 134.6,57.44 134.79,57.25 | 134.79,57.25 137.27,54.77 137.27,47.54 Q12.S 137.65,47.15 | 5VOUT.20 239.76,100.88 242.05,100.88 5VOUT.18 242.43,100.88 244.33,100.88 5VOUT.16 244.71,100.88 247,100.88 5VOUT.14 247.38,100.88 249.66,100.88 5VOUT.12 250.05,100.88 251.95,100.88 5VOUT.10 252.33,100.88 254.62,100.88 5VOUT.8 | 250.05,93.64 250.05,91.35 IC1.2 250.05,90.97 250.05,90.21 251.57,88.68 254.09,88.68 255,89.59 255,100.5 5VOUT.8 | 250.05,93.64 250.05,95.16 C4.2 | 5VOUT.8 255,100.88 257.28,100.88 5VOUT.6 257.67,100.88 259.57,100.88 5VOUT.4 259.95,100.88 262.24,100.88 5VOUT.2 | 218.23,62.97 219.19,62.01 LED1.K
  Bottom 0.762: 218.23,62.97 218.04,63.16 215.76,63.16 R3.2 215.76,62.78 211.18,58.2 211.18,47.54 Q2.S 211.95,46.91 211.95,29.63 210.8,28.49 208.52,28.49 202.42,34.58 200.13,34.58 198.8,33.25 | 196.71,63.54 198.99,63.54 200.52,62.01 LED2.K | 196.71,63.54 R5.2 | 196.71,63.54 196.71,63.16 194.42,60.87 194.42,47.54 Q4.S 194.42,47.15 194.42,37.63 198.8,33.25 | R7.2 176.51,63.16 178.8,63.16 179.94,62.01 LED3.K 180.32,61.63 181.85,60.11 181.85,58.58 178.42,55.16 178.42,47.54 Q6.S 178.42,46.77 178.42,40.68 185.85,33.25 | R9.2 154.8,62.39 155.18,62.01 157.46,62.01 LED4.K 157.84,61.63 164.32,55.16 164.32,47.15 Q8.S 164.7,46.77 173.08,38.39 173.08,34.58 | 162.99,35.53 170.42,28.1 171.56,28.1 173.08,29.63 173.08,34.58 | 162.99,35.53 151.75,46.77 150.99,46.77 Q10.S | 185.85,33.25 186.04,33.06 186.04,29.63 184.51,28.1 182.99,28.1 176.51,34.58 173.08,34.58 | 198.8,33.25 198.99,33.06 198.99,29.63 197.85,28.49 195.56,28.49 189.85,34.2 186.8,34.2 185.85,33.25 | 250.05,93.64 238.38,93.64 218.42,73.68 218.42,63.16 218.23,62.97 | 137.65,47.15 137.91,47.15 146.91,38.16 | 162.99,35.53 160.51,33.06 160.51,30.01 158.99,28.49 156.58,28.49 155.16,29.91 155.16,31.41 148.41,38.16 146.91,38.16 | C9.2 223.12,95.69 223.12,107.61 210.42,120.31 U$4.P$2 210.04,120.69 190.24,140.49 169.7,140.49 167.37,138.16 167.37,136.4 D3.K | D3.K D2.K 156.23,136.02 150.34,141.91 89.12,141.91 U$1.P1 | 137.65,47.15 147.29,37.51 147.29,28.13 142.65,23.49 140.08,23.49 v113.91,49.66 | v98.91,79.16 98.78,79.03 U$1.P21 | D3.K 175.05,136.02 178.91,132.16 SV4.15 U$2.P30
GND@2
  Bottom 0.762: X1.1 115.17,147.74 113.27,149.64 113.27,156.5 C3.2 113.27,156.88 115.17,158.79 115.17,166.79 X2.4 115.55,166.79 130.79,166.79 U$5.P$4
GND@3  (via drill 2.03 pad 5)
  Top 0.762: v75.91,10.16 75.91,32.66 v64.41,44.16
  Bottom 0.762: MOTOR1.2 71,158.2 67.38,154.58 67.38,127.26 50.36,110.24 50.36,90.16 | U$4.P$4 250.4,120.32 258.06,112.66 267.41,112.66 270.41,109.66 270.41,11.16 262.41,3.16 151.62,3.16 | MOTORIGHT.1 67.86,20.13 63.12,24.87 63.12,42.87 v64.41,44.16 | 50.36,90.16 50.36,52.66 | MOTORLEFT.1 74.36,8.51 75.86,10.01 75.86,9.16 75.91,9.16 | MOTOR3.2 105.82,95.75 107.32,94.25 107.32,56.16 108.52,54.96 108.52,46.26 151.62,3.16 | MOTOR2.2 27.58,104.75 35.77,104.75 50.36,90.16 | 75.91,9.16 75.91,5.16 77.91,3.16 151.62,3.16 | 75.91,9.16 v75.91,10.16
  Bottom 1.016: 50.36,52.66 63.12,39.9 63.12,24.87
GND@4
  Bottom 0.762: 5V5AOUT1.20 265.29,115.35 265.29,117.64 5V5AOUT1.18 265.29,118.02 265.29,120.31 5V5AOUT1.16 265.29,120.69 265.29,122.59 5V5AOUT1.14 265.29,122.97 265.29,125.26 5V5AOUT1.12 265.29,125.64 265.29,127.93 5V5AOUT1.10 265.29,128.31 265.29,130.21 5V5AOUT1.8 265.29,130.59 265.29,132.88 5V5AOUT1.6 265.29,133.26 265.29,135.55 5V5AOUT1.4 265.29,135.93 265.29,137.83 5V5AOUT1.2 266.54,139.56 266.54,150.56 264.41,152.69 U$3.P$4
INA1
  Bottom 1.016: MOTOR1.6 81.16,158.44 74.91,152.19 74.91,129.84 82.54,122.21 U$1.P12
INA2  (via drill 2.03 pad 5)
  Top 1.524: v38.91,108.66 42.91,108.66 77.91,73.66 77.91,48.16 v80.41,48.16
  Bottom 1.016: U$1.P32 83.83,58.71 82.41,57.29 82.41,50.16 v80.41,48.16
  Bottom 1.524: MOTOR2.6 34.16,115.41 38.91,110.66 v38.91,108.66
INA3
  Bottom 1.016: MOTOR3.6 105.15,105.91 105.98,106.73 105.98,109.16 103.97,111.18 85.27,111.18 76.39,102.29 76.39,75.42 80.4,71.41 U$1.P37
INB1
  Bottom 1.016: MOTOR1.5 78.62,158.2 72.64,152.22 72.64,128.21 80.93,119.93 85.07,119.93 U$1.P11
INB2  (via drill 2.03 pad 5)
  Top 1.524: v31.91,108.66 70.91,69.66 70.91,49.66 76.91,43.66 83.41,43.66 v85.91,46.16
  Bottom 1.016: U$1.P31 85.41,56.09 85.41,46.66 v85.91,46.16
  Bottom 1.524: MOTOR2.5 29.7,112.87 31.91,110.66 v31.91,108.66
INB3
  Bottom 1.016: U$1.P36 84.82,69.38 79.28,69.38 73.86,74.79 73.86,102.92 84.14,113.2 104.6,113.2 107.5,110.3 107.5,105.22 105.47,103.18 103.73,103.18 MOTOR3.5
M1
  Bottom 1.016: D4.A 208.49,87.4 198.16,97.73 132.27,97.73 131.41,98.59 131.41,119.66 111.33,139.74 88.12,139.74 U$1.P2
M2
  Bottom 1.016: D5.A 188.7,86.02 186.08,86.02 176.89,95.21 130.13,95.21 128.29,97.04 128.29,118.28 109.12,137.45 U$1.P3
M3
  Bottom 1.016: D6.A 170.42,86.02 167.1,86.02 160.44,92.69 129.36,92.69 125.4,96.65 125.4,116.17 106.78,134.78 88.12,134.78 U$1.P4
M4
  Bottom 1.016: D7.A 147.04,90.02 128.67,90.02 122.22,96.47 122.22,114.35 111.82,124.75 U$1.P8
M5
  Bottom 1.016: D8.A 118.92,95.45 118.92,113.15 109.86,122.21 U$1.P9
M6
  Bottom 1.016: D9.A 112.89,84.87 112.89,88.16 115.41,90.68 115.41,111.66 107.4,119.67 U$1.P10
MISO
  Bottom 1.016: SV3.11 168.51,102.4 166.23,102.4 SV3.10 166.23,102.78 166.23,107.35 U$2.P19 166.61,107.73 168.51,107.73 U$2.P21
N$1
  Bottom 1.016: 255.76,47.92 S1.1
  Bottom 2.54: 255.76,47.92 255.76,32.96 257.49,31.24 259.34,29.38 X4.1
N$2
  Bottom 2: F1.1A 257.58,57.63 259.43,55.77 259.43,51.68 258.46,50.71 S1.2
N$3
  Bottom 1.016: R1.1 224.14,56.3 224.14,58.97 R2.2 224.14,59.35 224.14,59.73 233.28,68.87 IC2.1
N$4
  Bottom 1.016: SV3.1 143.37,102.78 143.37,107.35 U$2.P1
N$5
  Bottom 1.016: 226.16,48.41 228.71,50.96 C8.2 | 226.16,48.41 224.71,46.96 | 224.71,46.96 224.14,46.39 R1.2 | C2.- 229.85,31.53 229.85,41.82 C1.- 229.47,42.2 224.71,46.96 | 226.16,48.41
N$8
  Bottom 1.016: SV3.2 146.03,102.78 146.03,107.35 U$2.P3
N$9
  Bottom 1.016: SV3.3 148.7,102.78 148.7,107.35 U$2.P5
N$10
  Bottom 1.016: SV3.4 150.99,102.78 150.99,107.35 U$2.P7
N$11
  Bottom 1.016: SV3.6 156.32,102.78 156.32,107.35 U$2.P11
N$12
  Bottom 1.016: SV3.7 158.61,102.78 158.61,107.35 U$2.P13
N$13
  Bottom 1.016: SV3.8 161.27,102.78 161.27,107.35 U$2.P15
N$14
  Bottom 2: F1.2A 261.9,78.45 D1.A
N$17
  Bottom 1.016: SV3.14 176.51,102.78 176.51,107.35 U$2.P27
N$18
  Bottom 1.016: SV3.15 179.18,102.78 179.18,107.35 U$2.P29
N$19
  Bottom 1.016: SV3.16 181.47,102.78 181.47,107.35 U$2.P31
N$20
  Bottom 1.016: SV3.17 184.13,102.78 184.13,107.35 U$2.P33
N$21
  Bottom 1.016: SV3.18 186.8,102.78 186.8,107.35 U$2.P35
N$22
  Bottom 1.016: SV3.19 189.09,102.78 189.09,107.35 U$2.P37
N$23
  Bottom 1.016: SV4.1 143.37,127.55 143.37,122.97 U$2.P2
N$24
  Bottom 1.016: Q1.B 208.14,70.78 208.14,74.97 D4.C
N$26
  Bottom 1.016: SV4.6 156.32,127.55 156.32,122.97 U$2.P12
N$27
  Bottom 1.016: D3.A 165.48,133.48 163.94,131.94 163.94,127.93 SV4.9 163.56,127.55 163.56,122.97 U$2.P18
N$28
  Bottom 1.016: Q1.E 205.47,70.4 205.47,63.54 R3.1 205.47,63.16 205.47,58.2 R4.1 205.85,57.82 205.85,47.54 Q2.G
N$29
  Bottom 1.016: SV4.11 168.89,127.55 168.89,122.97 U$2.P22
N$30
  Bottom 1.016: R4.2 215.76,58.2 218.42,58.2 219.19,58.97 LED1.A
N$31
  Bottom 1.016: Q3.B 189.09,70.78 189.09,75.35 D5.C
N$32
  Bottom 1.016: SV4.13 173.85,127.55 173.85,122.97 U$2.P26
N$33
  Bottom 1.016: SV4.14 176.51,127.55 176.51,122.97 U$2.P28
N$34
  Bottom 1.016: SV4.16 181.47,127.55 181.47,122.97 U$2.P32
N$35
  Bottom 1.016: SV4.18 186.8,127.55 186.8,122.97 U$2.P36
N$36
  Bottom 1.016: SV4.19 189.09,127.55 189.09,122.97 U$2.P38
N$37
  Bottom 1.016: SV4.20 191.75,127.55 191.75,122.97 U$2.P40
N$38
  Bottom 1.016: D2.A 159.48,133.48 160.89,132.07 160.89,127.93 SV4.8 161.27,127.55 161.27,122.97 U$2.P16
N$39
  Bottom 1.016: Q2.D 208.38,39.24 206.52,37.38 206.52,34.68 209.66,31.53 X3.1
N$40
  Bottom 1.016: X5.1 122.57,18.83 117.36,24.03 113.34,24.03 SL4.9 112.96,24.8 112.96,30.68 105.88,37.75 105.88,64.49 94.26,76.11 88.12,76.11 U$1.P22
N$41
  Bottom 1.016: Q3.E 191.37,70.4 191.37,69.25 186.42,64.3 R5.1 186.42,63.54 186.8,63.16 186.8,57.82 R6.1 187.18,57.44 189.09,55.54 189.09,47.54 Q4.G
N$42
  Bottom 1.016: R6.2 197.47,57.82 199.37,57.82 200.52,58.97 LED2.A
N$43
  Bottom 1.016: Q4.D 192.13,47.15 192.13,36.11 196.71,31.53 X7.1
N$44
  Bottom 1.016: Q5.B 170.04,71.16 170.04,74.97 170.42,75.35 D6.C
N$45
  Bottom 1.016: Q5.E 172.32,70.78 172.32,69.25 166.61,63.54 R7.1 166.61,63.16 166.99,62.78 166.99,58.58 R8.1 166.99,57.82 173.08,51.73 173.08,47.54 Q6.G
N$46
  Bottom 1.016: R8.2 177.28,58.58 179.56,58.58 179.94,58.97 LED3.A
N$47
  Bottom 1.016: Q6.D 176.13,47.15 176.13,39.15 183.75,31.53 X8.1
N$48
  Bottom 1.016: Q7.B 147.94,70.4 147.94,75.35 D7.C
N$49
  Bottom 1.016: Q7.E 150.22,70.02 150.22,68.87 144.51,63.16 R9.1 144.51,62.39 144.51,58.2 144.89,57.82 R10.1 145.27,57.44 155.56,47.15 158.99,47.15 Q8.G
N$50
  Bottom 1.016: R10.2 155.18,57.82 156.32,57.82 157.46,58.97 LED4.A
N$51
  Bottom 1.016: Q8.D 162.03,46.77 162.03,44.81 170.97,35 X9.1
N$52
  Bottom 1.016: Q9.B 128.89,70.78 128.89,75.35 D8.C
N$53
  Bottom 1.016: R12.1 125.84,58.2 125.84,61.63 125.46,62.01 R11.1 125.46,62.39 131.17,68.11 | 131.17,68.11 131.17,70.4 Q9.E | 131.17,68.11 135.37,68.11 141.08,62.39 141.08,58.97 145.65,54.39 145.65,47.15 Q10.G
N$54
  Bottom 1.016: R12.2 136.51,58.2 138.41,58.2 139.18,58.97 LED5.A
N$55
  Bottom 1.016: Q10.D 148.7,46.77 148.7,44.18 157.87,35.01 X10.1
N$56
  Bottom 1.016: Q11.B 113.65,69.25 113.65,74.21 113.27,74.59 D9.C
N$57
  Bottom 1.016: Q11.E 116.31,68.87 115.55,68.11 115.55,67.73 110.6,62.78 109.46,62.78 R13.1 109.08,62.39 109.08,58.58 R14.1 112.42,58.62 123.51,47.54 131.94,47.54 Q12.G
N$58
  Bottom 1.016: R14.2 119.36,58.58 122.41,58.58 122.79,58.97 LED6.A
N$59
  Bottom 1.016: X11.1 144.76,35.28 134.98,45.06 134.98,47.15 Q12.D
N$60
  Bottom 1.016: X5.2 118.85,13.1 110.67,21.27 110.67,24.03 SL4.8 110.51,24.46 110.51,30.51 103.86,37.16 103.86,63.73 93.76,73.82 88.12,73.82 U$1.P23
N$61
  Bottom 1.016: X5.3 113.92,12.15 108,18.63 108,24.03 SL4.7 108.1,24.53 108.1,30.27 101.96,36.41 101.96,62.46 93.26,71.16 88.12,71.16 U$1.P24
N$62
  Bottom 1.016: X5.4 108.91,11.97 105.72,16.08 105.72,24.03 SL4.6 105.37,30.45 99.93,35.89 99.93,61.32 92.76,68.49 88.12,68.49 U$1.P25
N$63
  Bottom 1.016: X5.5 103.05,12.94 103.05,24.03 SL4.5 102.83,29.95 98.41,34.37 98.41,60.06 92.26,66.2 88.12,66.2 U$1.P26
N$64
  Bottom 1.016: X5.6 98.91,12.3 100.5,15.41 100.5,24.13 SL4.4 100.48,24.53 100.48,28.77 96.38,32.86 96.38,58.92 91.76,63.54 88.12,63.54 U$1.P27
N$65
  Bottom 1.016: X5.7 93.9,14.31 97.72,20.19 97.72,24.03 SL4.3 97.75,27.84 94.19,31.4 94.19,57.44 90.76,60.87 88.12,60.87 U$1.P28
N$66
  Bottom 1.016: X5.8 88.9,15.05 95.05,22.89 95.05,24.03 SL4.2 95.21,26.84 92.05,30 92.05,55.8 89.26,58.58 88.12,58.58 U$1.P29
N$67
  Bottom 1.016: 88.76,24.03 90.12,24.03 | 88.76,24.03 87.71,22.89 83.89,18.75 X5.9 | 90.12,24.03 90.12,24.66 | 90.12,24.66 90.12,25.16 | 89.62,25.16 89.62,24.89 88.76,24.03 | 89.62,25.16 89.62,54.41 U$1.P30 | 92.36,24.03 SL4.1 90.44,24.34 90.12,24.66 | 92.36,24.03 92.91,24.03 91.78,25.16 90.12,25.16 | 92.36,24.03 90.12,24.03 | 89.62,25.16 90.12,25.16
N$68
  Bottom 1.016: X12.1 17.25,161.84 26.4,152.69 SL6.9 27.16,152.69 27.54,152.69 40.11,140.12 42.02,140.12 U$1.P79
N$69
  Bottom 1.016: X12.2 17.64,156.88 24.11,150.41 26.4,150.41 SL6.8 27.16,150.03 27.54,150.03 40.11,137.45 42.02,137.45 U$1.P78
N$70
  Bottom 1.016: X12.3 17.64,151.93 21.83,147.74 26.4,147.74 SL6.7 27.16,147.36 27.92,147.36 40.11,135.17 42.02,135.17 U$1.P77
N$71
  Bottom 1.016: X12.4 17.64,146.98 19.54,145.07 26.4,145.07 SL6.6 27.16,145.07 27.54,145.07 40.11,132.5 42.02,132.5 U$1.P76
N$72
  Bottom 1.016: X12.5 17.64,142.41 26.4,142.41 SL6.5 27.16,142.79 40.11,129.83 42.02,129.83 U$1.P75
N$73
  Bottom 1.016: X12.6 17.64,137.45 19.92,139.74 26.4,139.74 SL6.4 27.16,139.74 27.92,139.74 40.11,127.55 42.02,127.55 U$1.P74
N$74
  Bottom 1.016: X12.7 17.64,132.5 22.21,137.07 26.4,137.07 SL6.3 27.16,137.45 27.54,137.45 40.11,124.88 42.02,124.88 U$1.P73
N$75
  Bottom 1.016: X12.8 17.64,127.16 25.26,134.78 26.4,134.78 SL6.2 27.16,135.17 40.11,122.21 42.02,122.21 U$1.P72
N$76
  Bottom 1.016: 26.4,130.97 26.4,132.12 SL6.1 | 26.4,130.97 17.64,122.21 X12.9 | U$1.P71 42.02,119.93 38.83,119.93 27.78,130.97 26.4,130.97
N$77
  Bottom 1.016: X6.1 19.91,99.17 26.78,92.97 26.78,87.92 SL5.9 37.82,87.64 40.12,85.35 40.12,77.59 41.69,76.03 U$1.P59
N$78
  Bottom 1.016: U$1.P58 42.02,74.21 40.47,74.21 38.46,76.21 38.46,82.61 35.97,85.1 SL5.8 26.78,85.25 25.52,85.25 23.26,87.51 23.26,91.81 20.91,94.16 X6.2
N$79
  Bottom 1.016: U$1.P57 42.02,71.54 40.47,71.54 36.38,75.63 36.38,81.13 36.41,81.16 35.01,82.56 SL5.7 26.78,82.59 24.11,82.59 20.98,85.72 20.98,88.59 20.4,89.17 X6.3
N$80
  Bottom 1.016: U$1.P56 42.02,68.87 39.97,68.87 34.55,74.3 34.55,78.52 33.05,80.02 SL5.6 26.78,80.3 22.41,80.3 18.55,84.16 X6.4
N$81
  Bottom 1.016: X6.5 17.64,79.16 19.16,77.63 26.78,77.63 SL5.5 30.59,77.48 32.41,75.66 32.41,73.15 38.97,66.59 42.02,66.59 U$1.P55
N$82
  Bottom 1.016: X6.6 17.64,74.21 18.37,74.94 SL5.4 29.63,74.94 30.39,74.18 30.39,72.5 38.97,63.92 42.02,63.92 U$1.P54
N$83
  Bottom 1.016: X6.7 19.53,69.15 22.68,72.3 26.78,72.3 SL5.3 27.72,72.4 33.57,66.55 33.57,62.55 34.87,61.25 42.02,61.25 U$1.P53
N$84
  Bottom 1.016: X6.8 19.48,64.15 24.97,69.63 26.78,69.63 SL5.2 27.42,69.55 28.04,69.55 30.55,67.03 30.55,61.02 32.86,58.71 U$1.P52
N$85
  Bottom 1.016: X6.9 19.83,59.14 27.11,66.42 SL5.1 27.11,59.82 30.63,56.3 42.02,56.3 U$1.P51
N$86
  Bottom 1.016: ANALOGS.8 47.35,159.55 47.35,137.98 46.83,137.45 45.07,137.45 U$1.P63
N$87
  Bottom 1.016: ANALOGS.7 49.64,159.55 49.64,136.59 48.21,135.17 45.07,135.17 U$1.P64
N$88
  Bottom 1.016: ANALOGS.6 52.31,159.55 52.31,135.98 48.83,132.5 45.07,132.5 U$1.P65
N$89
  Bottom 1.016: ANALOGS.5 54.97,159.55 54.97,134.98 49.83,129.83 45.07,129.83 U$1.P66
N$90
  Bottom 1.016: ANALOGS.4 57.26,159.55 57.26,133.59 51.21,127.55 45.07,127.55 U$1.P67
N$91
  Bottom 1.016: ANALOGS.3 59.93,159.55 59.93,132.98 51.83,124.88 45.07,124.88 U$1.P68
N$92
  Bottom 1.016: ANALOGS.2 62.59,159.55 62.59,131.98 52.83,122.21 45.07,122.21 U$1.P69
N$93
  Bottom 1.016: ANALOGS.1 64.88,159.55 64.88,130.59 54.21,119.93 45.07,119.93 U$1.P70
PWM1
  Bottom 1.016: MOTORLEFT.8 59.24,6.97 19.63,6.97 4.34,22.27 4.34,169.55 6.52,171.73 91.3,171.73 94.46,168.58 94.46,152.9 85.33,143.77 U$1.P20
PWM2
  Bottom 1.016: MOTORLEFT.7 57.74,11.01 20.25,11.01 5.86,25.4 5.86,167.92 8.15,170.21 89.67,170.21 91.93,167.95 91.93,153.53 81.98,143.58 81.98,141.42 83.41,139.99 U$1.P19
PWM3
  Bottom 1.016: U$1.P18 84.82,136.94 82.18,136.94 79.96,139.16 79.96,144.71 89.41,154.16 89.41,166.31 87.04,168.68 9.78,168.68 7.89,166.79 7.89,28.03 21.01,14.9 59.55,14.9 MOTORIGHT.8
PWM4
  Bottom 1.016: U$1.P17 84.82,134.4 80.69,134.4 77.93,137.16 77.93,145.18 87.41,154.66 87.41,164.16 84.91,166.66 11.91,166.66 9.41,164.16 9.41,31.16 22.44,18.13 MOTORIGHT.7
PWM5  (via drill 2.03 pad 5)
  Top 1.524: v31.41,120.16 34.91,120.16 65.41,89.66 v91.41,89.66
  Bottom 1.016: U$1.P40 85.33,83.58 v91.41,89.66
  Bottom 1.524: MOTOR2.7 29.29,120.16 v31.41,120.16
PWM6
  Bottom 1.016: MOTOR3.7 98.2,108.45 80.41,90.66 80.41,79.66 83.58,76.49 U$1.P39
PWM7  (via drill 2.03 pad 5)
  Top 1.016: v81.91,100.16 81.91,150.16 v79.91,152.16
  Bottom 1.016: MOTOR1.7 83.41,158.91 83.41,155.66 v79.91,152.16 | U$1.P38 82.12,73.95 78.89,77.18 78.89,97.14 v81.91,100.16
RASNET
  pour Bottom (isolate 1.676): -0.09,176.66 271.91,176.66 271.91,0.16 -0.09,0.16
RX
  Bottom 1.016: SV4.5 153.65,127.55 153.65,122.97 U$2.P10
TX
  Bottom 1.016: SV4.4 150.99,127.55 150.99,122.97 U$2.P8
VIN
  Bottom 2.032: 162.8,29.25 162.8,31.15 X10.2 | 162.8,29.25 160.13,26.58 154.41,26.58 149.84,31.15 X11.2 | 175.75,29.25 175.75,31.15 X9.2 | 175.75,29.25 172.7,26.2 166.23,26.2 163.56,28.87 162.8,29.25 | 188.7,29.25 188.7,31.15 X8.2 | 188.7,29.25 185.66,26.2 179.18,26.2 176.51,28.87 175.75,29.25 | 201.66,29.25 201.66,31.15 X7.2 | 201.66,29.25 198.99,26.58 191.75,26.58 189.47,28.87 188.7,29.25 | X3.2 215.11,31.14 215.11,27.75 213.95,26.58 204.71,26.58 202.42,28.87 201.66,29.25 | 193.85,154.41 205.09,165.65 U$3.P$1 | 193.85,154.41 190.99,151.55 U$5.P$1 | 248.21,88.61 250.05,86.78 261.1,86.78 262.24,87.92 D1.C 263.88,88.2 265.9,93.86 265.9,105.69 264.38,107.21 233.28,107.21 | 248.21,88.61 247.38,89.45 247.38,90.97 IC1.1 | 233.28,107.21 233.28,114.21 210.42,137.07 U$4.P$1 210.04,138.21 193.85,154.41 | 248.21,88.61 247.34,87.73 247.34,82.08 240.99,75.73 228.83,75.73 221.85,68.75 221.85,58.08 216.99,53.23 216.99,33.5 X3.2 | C9.1 233.28,97.98 233.28,107.21 | X3.2 220.91,37.42 220.91,50.16 224.45,53.7 238.62,53.7 | C1.+ 234.77,49.35 C8.1 238.62,53.2 238.62,53.7 | 238.62,53.7 239.62,53.7 239.62,68.03 IC2.3

### Text on the board
Bottom: SEEKER UCB TIVABOARD | SEEKER UCB TIVABOARD